# EAGLE schematic Motor Control, LEDs, Buttons (EAGLE 9.5.2)
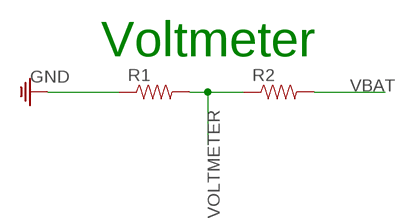
[diagram p0: schematic, sheet 1]

## Parts
R1  RESISTOR_0805IN_2012MM  [0805]
R2  RESISTOR_0805IN_2012MM  [0805]

## Nets
GND: R1.1
VBAT: R2.2
VOLTMETER: R1.2 R2.1

## Notes on the sheet
- Voltmeter

## Library data of the parts
R1 R2 = RESISTOR_0805IN_2012MM:RESISTOR_0805IN_2012MM